# Altium project First_plate_stm32.PrjPcb
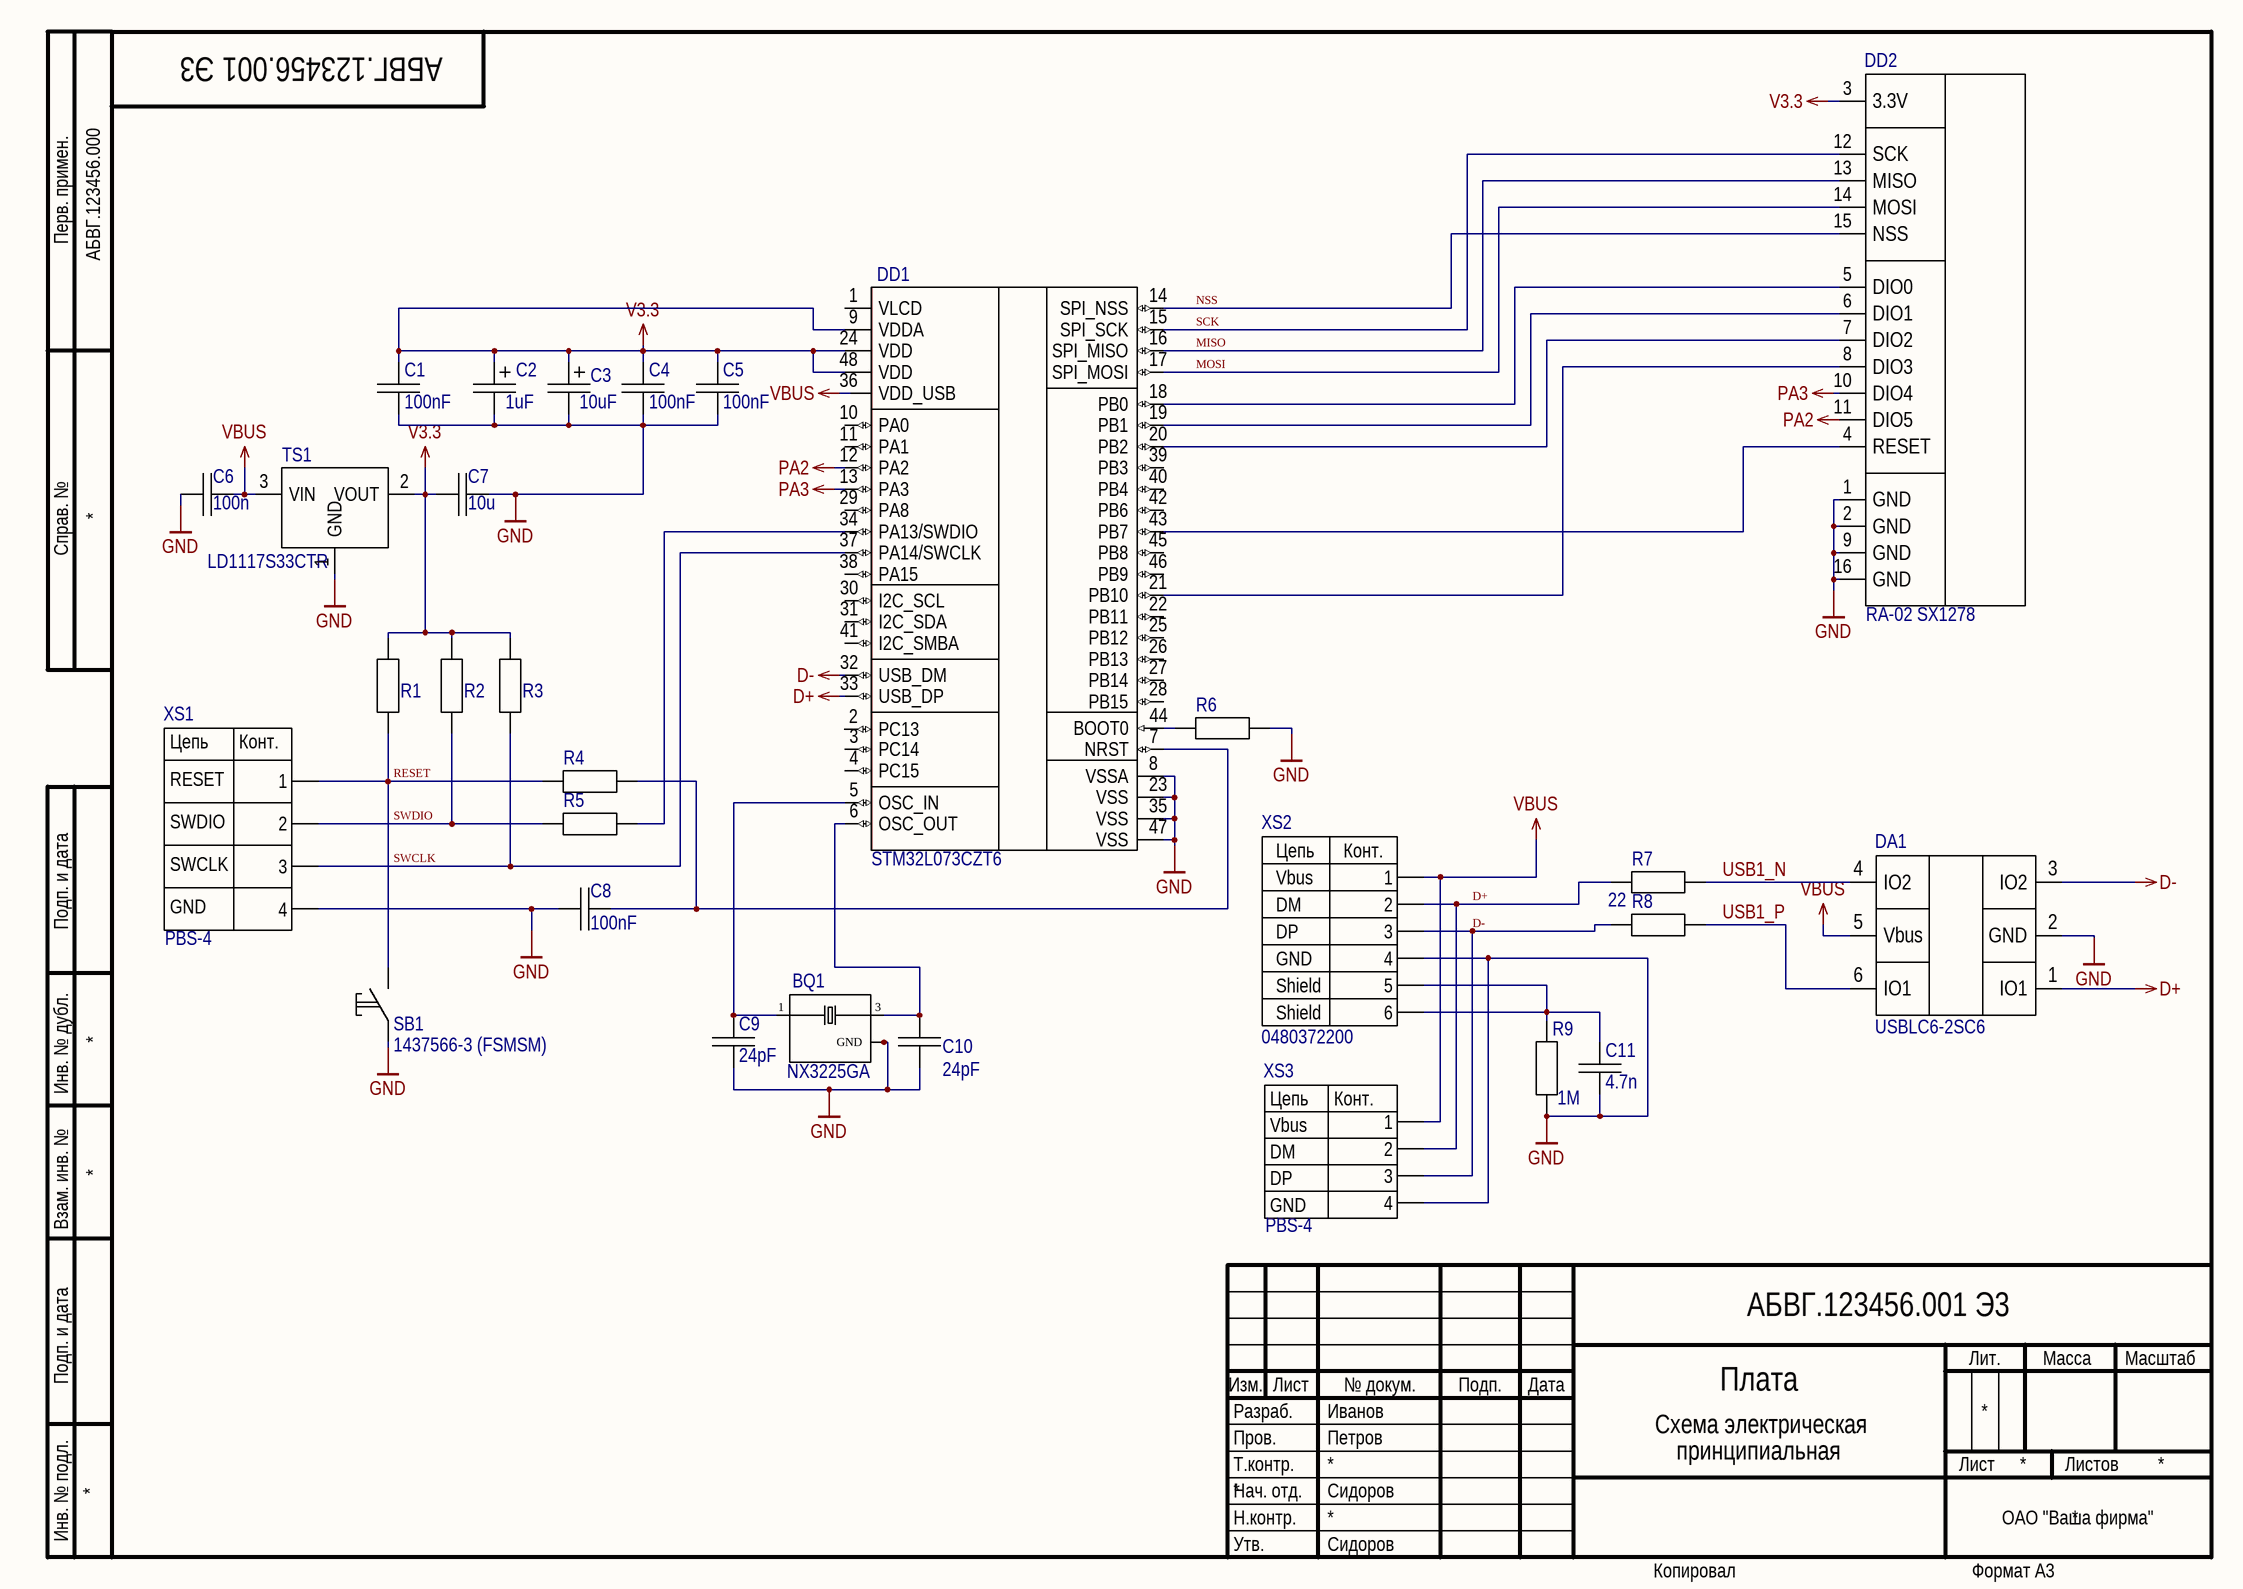
[diagram p0: LoraSTM32.SchDoc]
1 sheet, 29 parts. Net scope: global (net labels, ports and power ports of the same name join across sheets).
Board file: LoRaSTM32_1.PcbDoc

## Sheet LoraSTM32.SchDoc
size 420 x 297 mm; Scale: 1:1; Разраб.: Иванов; Обозначение документа: АБВГ.123456.001 Э3; Пров.: Петров; Утв.: Сидоров; Наименование организации: ОАО "Ваша фирма"; Перв. применение: АБВГ.123456.000; Наименование изделия 1: Плата; Наименование изделия 2: Схема электрическая; Наименование изделия 3: принципиальная; Нач. отд.: Нач. отд.; Фамилия нач. отд.: Сидоров

### Parts
BQ1  NX3225GA  [NDK_NX3225GA_0]
C1  GRM188R71H104K: 100nF  [CAPC1608X09L]  (hidden comment: *)
C2  TECAP1/16VA10: 1uF  [CAPMP3216X16N-A]  (hidden comment: *)
C3  TECAP10/10VA10: 10uF  [CAPMP3216X16N-A]  (hidden comment: *)
C4  GRM188R71H104K: 100nF  [CAPC1608X09L]  (hidden comment: GRM188R72A104KA35D)
C5  GRM188R71H104K: 100nF  [CAPC1608X09L]  (hidden comment: *)
C6  GRM188R71H104K: 100n  [CAPC1608X09L]  (hidden comment: *)
C7  GRM188R61E106M: 10u  [CAPC1608X09L]  (hidden comment: *)
C8  GRM188R71H104K: 100nF  [CAPC1608X09L]  (hidden comment: *)
C9  GRM1885C1H240J: 24pF  [CAPC1608X09L]  (hidden comment: *)
C10  GRM1887U1H472JA01D: 24pF  [CAPC1608X09L]  (hidden comment: *)
C11  value 4.7n  [CAPC1608X09L]  (hidden comment: *)
DA1  USBLC6-2SC6  [SOT95P280X145-6N]
DD1  STM32L073CZT6  [*QFP50P900X900X160-48N]
DD2  RA-02 SX1278  [RA-02]
R1  R1608  [RESC1608X05N]  (value not drawn)
R2  R1608  [RESC1608X05N]  (value not drawn)
R3  R1608  [RESC1608X05N]  (value not drawn)
R4  R1608  [RESC1608X05N]  (value not drawn)
R5  R1608  [RESC1608X05N]  (value not drawn)
R6  R1608  [RESC1608X05N]  (value not drawn)
R7  R1608  [RESC1608X05N]  (value not drawn)
R8  value 22  [RESC1608X05N]  (hidden comment: R1608)
R9  value 1M  [RESC1608X05N]  (hidden comment: R1608)
SB1  1437566-3 (FSMSM)  [*SW_1437566-4]
TS1  LD1117S33CTR  [*SOT223]
XS1  PBS-4  [PBS-4]
XS2  Part Number: 0480372200  [Molex_0480372200_0]  (hidden comment: Conn_Molex_0480372200_eec)
XS3  PBS-4  [PBS-4]

### Nets
D+: DA1.1(IO1) DD1.33(USB_DP) R7.2 XS2.2 XS3.2
D-: DA1.3(IO2) DD1.32(USB_DM) R8.2 XS2.3 XS3.3
GND: BQ1.2(GND) BQ1.4(GND) C1.2 C2.2 C3.2 C4.2 C5.2 C6.2 C7.1 C8.1 C9.1 C10.1 C11.1 DA1.2(GND) DD1.8(VSSA) DD1.23(VSS) DD1.35(VSS) DD1.47(VSS) DD2.1(GND) DD2.2(GND) DD2.9(GND) DD2.16(GND) R6.1 R9.1 SB1.1 TS1.1(GND) XS1.4 XS2.4 XS3.4
PA2: DD1.12(PA2) DD2.11(DIO5)
PA3: DD1.13(PA3) DD2.10(DIO4)
V3.3: C1.1 C2.1 C3.1 C4.1 C5.1 C7.2 DD1.9(VDDA) DD1.24(VDD) DD1.48(VDD) DD2.3(3.3V) R1.1 R2.1 R3.1 TS1.2(VOUT)
VBUS: C6.1 DA1.5(Vbus) DD1.36(VDD_USB) TS1.3(VIN) XS2.1 XS3.1
MISO: DD1.16(SPI_MISO) DD2.13(MISO)
MOSI: DD1.17(SPI_MOSI) DD2.14(MOSI)
NSS: DD1.14(SPI_NSS) DD2.15(NSS)
RESET: R1.2 R4.2 SB1.2 XS1.1
SCK: DD1.15(SPI_SCK) DD2.12(SCK)
SWCLK: DD1.37(PA14/SWCLK) R3.2 XS1.3
SWDIO: R2.2 R5.2 XS1.2
USB1_N: DA1.4(IO2) R7.1
USB1_P: DA1.6(IO1) R8.1
NetBQ1_1: BQ1.1 C9.2 DD1.5(OSC_IN)
NetBQ1_3: BQ1.3 C10.2 DD1.6(OSC_OUT)
NetC8_2: C8.2 DD1.7(NRST) R4.1
NetC11_2: C11.2 R9.2 XS2.5(MNT_1) XS2.6(MNT_2)
NetDD1_18: DD1.18(PB0) DD2.5(DIO0)
NetDD1_19: DD1.19(PB1) DD2.6(DIO1)
NetDD1_20: DD1.20(PB2) DD2.7(DIO2)
NetDD1_21: DD1.21(PB10) DD2.8(DIO3)
NetDD1_34: DD1.34(PA13/SWDIO) R5.1
NetDD1_43: DD1.43(PB7) DD2.4(RESET)
NetDD1_44: DD1.44(BOOT0) R6.2

Not connected (* = marked no-connect by the designer): DD1 1(VLCD) 2(PC13) 3(PC14) 4(PC15) 10(PA0) 11(PA1) 22(PB11) 25(PB12) 26(PB13) 27(PB14) 28(PB15) 29(PA8) 30(I2C_SCL) 31(I2C_SDA) 38(PA15) 39(PB3) 40(PB4) 41(I2C_SMBA) 42(PB6) 45(PB8) 46(PB9)

### Notes on the sheet
- Перв. примен.
- Справ. №
- Подп. и дата
- Инв. № дубл.
- Взам. инв. №
- Разраб.
- Изм.
- Лист
- № докум.
- Подп.
- Дата
- Лит.
- Масса
- Масштаб
- Пров.
- Т.контр.
- Листов
- Инв. № подл.
- Утв.
- Н.контр.
- Копировал
- Формат А3
- (in symbol Conn_Molex_0480372200_eec) Цепь; Конт.; Vbus; DM; DP; GND; Shield
- (in symbol PBS-4) Цепь; Конт.; Vbus; DM; DP; GND
- (in symbol отладка swd) Цепь; Конт.; RESET; SWDIO; SWCLK; GND

### Library data of the parts
BQ1 = NX3225GA-25MHZ: NX3225GA-25MHZ 8pF, 25 МГц, 30/20ppm, 8пФ, -40...+85°C, SMD 3.2*2.5*0.75мм, Кварцевый резонатор; MF: NDK America, Inc.; Package: SMD-4 NDK America, Inc.; MP: NX3225GA-25MHZ 8pF; Availability: Unavailable; SnapEDA_Link: https://www.snapeda.com/parts/NX2520SA-24.000000MHZ-B8/NDK%20America%2C%20Inc./view-part/?ref=snap; Price: None; Value: *; ComponentLink1Description: buy; ComponentLink1URL: https://www.chipdip.ru/product0/9000523947; ComponentLink2Description: datasheet; ComponentLink2URL: https://static.chipdip.ru/lib/014/DOC004014815.pdf
C1 C4-C10 = CC1608: Конденсатор 1.6x0.8 мм; Tolerance: ±10%; ТКЕ: X7R; РКД Наименование: CC1608M - NP0 - 16 V - 10 nF ±10%; Voltage: *; Type: *; PartNo: *; Supplier Part Number 1: *; Supplier 1: *
C2 C3 = CT3216-A: Tantalum Surface Mount Capacitor, Size A; Voltage: 6.3V; Type: *; PartNo: *; Supplier Part Number 1: *; Supplier 1: *
C11 = CC1608: Конденсатор 1.6x0.8 мм; Tolerance: ±10%; ТКЕ: X7R; РКД Наименование: CC1608M - NP0 - 16 V - 4.7 nF ±10%; Voltage: *; Type: *; PartNo: *; Supplier Part Number 1: *; Supplier 1: *
DA1 = USBLC6-2SC6: USB protection IC; Manufacturer: STMicroelectronics; Direction: Bidirectional,Unidirectional; Capacitance: 3.5pF; Clamping Voltage: 17V; Operating Supply Voltage: 1.1V; Number of Channels: 2; Breakdown Voltage: 6V; Reverse Standoff Voltage: 5.25V; Power Line Protection: Yes; Test Current: 1mA; Max Reverse Leakage Current: 150nA; Peak Pulse Current: 5A; Element Configuration: Dual; Data Rate: 480Mbps; Number of Elements: 1; Working Voltage: 5V; PartNo: USBLC6-2SC6; Supplier 1: Digi-Key; Manufacturer Part Number: USBLC6-2SC6; Stock 1: 165611; Pricing 1: 1=0.49, 10=0.419, 100=0.3131, 500=0.24602, 1000=0.1901 (USD); Mount: Surface Mount; Case/Package: SOT-23; Number of Pins: 6; Contact Plating: Matte,Tin; Min Operating Temperature: -40°C; Max Operating Temperature: 125°C; Packaging: Tape and Reel; Package Quantity: 3000; Termination: SMD/SMT; Number of Bidirectional Channels: 2; Min Breakdown Voltage: 6V; ESD Protection: Yes; Leakage Current: 150nA; Reverse Breakdown Voltage: 6V; Polarity: Bidirectional,Unidirectional; Max Breakdown Voltage: 6V; Length: 3.05mm; Height: 1.3mm; Width: 1.75mm; Depth: 1.75mm; Radiation Hardening: No; REACH SVHC: No SVHC; Lead Free: Lead Free; ComponentLink1URL: http://www.farnell.com/datasheets/1690354.pdf; ComponentLink1Description: http://www.farnell.com/datasheets/1690354.pdf; ComponentLink2URL: http://www.st.com/content/ccc/resource/technical/document/datasheet/06/1d/48/9c/6c/20/4a/b2/CD00050750.pdf/files/CD00050750.pdf/jcr:content/translations/en.CD00050750.pdf; ComponentLink2Description: http://www.st.com/content/ccc/resource/technical/document/datasheet/06/1d/48/9c/6c/20/4a/b2/CD00050750.pdf/files/CD00050750.pdf/jcr:content/translations/en.CD00050750.pdf; ComponentLink3URL: http://www.st.com/web/en/resource/technical/document/datasheet/CD00050750.pdf; ComponentLink3Description: http://www.st.com/web/en/resource/technical/document/datasheet/CD00050750.pdf; ComponentLink4URL: http://datasheet.iiic.cc/stmicroelectronics/USBLC6-2SC6.pdf; ComponentLink4Description: http://datasheet.iiic.cc/stmicroelectronics/USBLC6-2SC6.pdf; ComponentLink5URL: http://www.produktinfo.conrad.com/datenblaetter/1100000-1199999/001184109-da-01-en-IC_ESD_PROTECTI_USBLC6_2SC6_SOT_23_6_STM.pdf; ComponentLink5Description: http://www.produktinfo.conrad.com/datenblaetter/1100000-1199999/001184109-da-01-en-IC_ESD_PROTECTI_USBLC6_2SC6_SOT_23_6_STM.pdf; Supplier Part Number 1: 497-5235-1-ND
DD1 = STM32L073CZT6: / ARMВ® CortexВ®-M0+ STM32 L0 Microcontroller IC 32-Bit 32MHz 192KB _192K x 8_ FLASH 48-LQFP /; MF: STMicroelectronics; SnapEDA_Link: https://www.snapeda.com/parts/STM32L073CZT6/STMicroelectronics/view-part/?ref=snap; Digi-Key_Purchase_URL: https://www.digikey.com/product-detail/en/stmicroelectronics/STM32L073CZT6/497-17506-ND/8024098?utm_source=snapeda&utm_medium=aggregator&utm_campaign=symbol; MP: STM32L073CZT6; Package: LQFP-48 STMicroelectronics; Digi-Key_Part_Number: 497-17506-ND; Value: *
DD2 = RA-02
R1-R3 = R1608: Резистор 1.6x0.8 мм; Tolerance: ±1%; РКД Наименование: RC1608M - 22 Ohm ±1%; Value: 10k; Type: *; PartNo: *; Supplier 1: *; Supplier Part Number 1: *
R4-R7 = R1608: Резистор 1.6x0.8 мм; Tolerance: ±1%; РКД Наименование: RC1608M - 22 Ohm ±1%; Value: 22; Type: *; PartNo: *; Supplier 1: *; Supplier Part Number 1: *
R8 R9 = R1608: Резистор 1.6x0.8 мм; Tolerance: ±1%; РКД Наименование: RC1608M - 22 Ohm ±1%; Type: *; PartNo: *; Supplier 1: *; Supplier Part Number 1: *
SB1 = FSMSM: 1437566-3 (FSMSM), Кнопка тактовая h=4.6 мм SMD SPST Switch Tactile / Switch Tactile OFF (ON) SPST Rectangular Button Gull Wing 0.05A 24VDC SMD Loose; Произвдитель: TE Connectivity; Артикул: 1437566-3 (FSMSM); ComponentLink1Description: buy; ComponentLink1URL: https://www.chipdip.ru/product/tyco-1437566-3-fsmsm; ComponentLink2Description: datasheet; ComponentLink2URL: https://static.chipdip.ru/lib/071/DOC000071159.pdf
TS1 = LD1117S33CTR: Linear Regulator / LDO Regulator Pos 3.3V 1.3A 4-Pin(3+Tab) SOT-223 T/R; Code_IPC: SOT-223; PackageVersion: revBB, Aug-2009; PackageReference: SOT-223; PackageDescription: 3-Lead Plastic Small Outline Transistor (TT) [SOT-23]; DatasheetVersion: revB, Feb-2007; PartNumber: LD1117S33CTR; ComponentLink1Description: buy; ComponentLink1URL: https://www.chipdip.ru/product/ld1117s33ctr-2; ComponentLink2Description: datasheet; ComponentLink2URL: https://static.chipdip.ru/lib/292/DOC000292513.pdf
XS1 = отладка swd: 2.54mm swdio; ComponentLink1Description: 3d; ComponentLink1URL: https://www.3dcontentcentral.com/secure/download-model.aspx?catalogid=171&id=455493; ComponentLink2Description: https://www.chipdip.ru/product/pld-6; ComponentLink2URL: https://www.chipdip.ru/product/pld-6
XS2 = Conn_Molex_0480372200_eec: CONN PLUG USB A 4POS SMD R/A; Manufacturer: Molex; Is Female: yes; Current - Maximum per Contact: 1.5A; Voltage - Maximum: 150V AC (RMS); helpURL: https://upverter.com/upn/revision/6bade1e906f93a88/; ComponentLink2Description: Datasheet; Temperature: -20°C to +85°C; Package: CONN_USB_12MM0_18MM75; Supplier 2: Mouser; Price: 0.972849437621; Supplier 1: Digi-Key; ComponentLink1URL: https://upverter.com/upn/revision/6bade1e906f93a88/; Supplier Part Number 2: 538-48037-2200; Supplier Part Number 1: WM3983CT-ND; ComponentLink1Description: Upverter; ComponentLink2URL: http://www.molex.com/pdm_docs/sd/480372200_sd.pdf; RoHS: TRUE; Mouser Part Number: 538-48037-2200; Temperature Range High: +85°C; Digikey Description: CONN PLUG USB A 4POS SMD R/A; Digikey Part Number: WM3983CT-ND; Lead Free: yes; Temperature Range Low: -20°C
XS3 = PBS-4: 2.54mm; ComponentLink1Description: 3d; ComponentLink1URL: https://www.3dcontentcentral.com/secure/download-model.aspx?catalogid=171&id=455493; ComponentLink2Description: https://www.chipdip.ru/product/pld-6; ComponentLink2URL: https://www.chipdip.ru/product/pld-6